# EAGLE design AntilogMM (EAGLE 9.0.1)
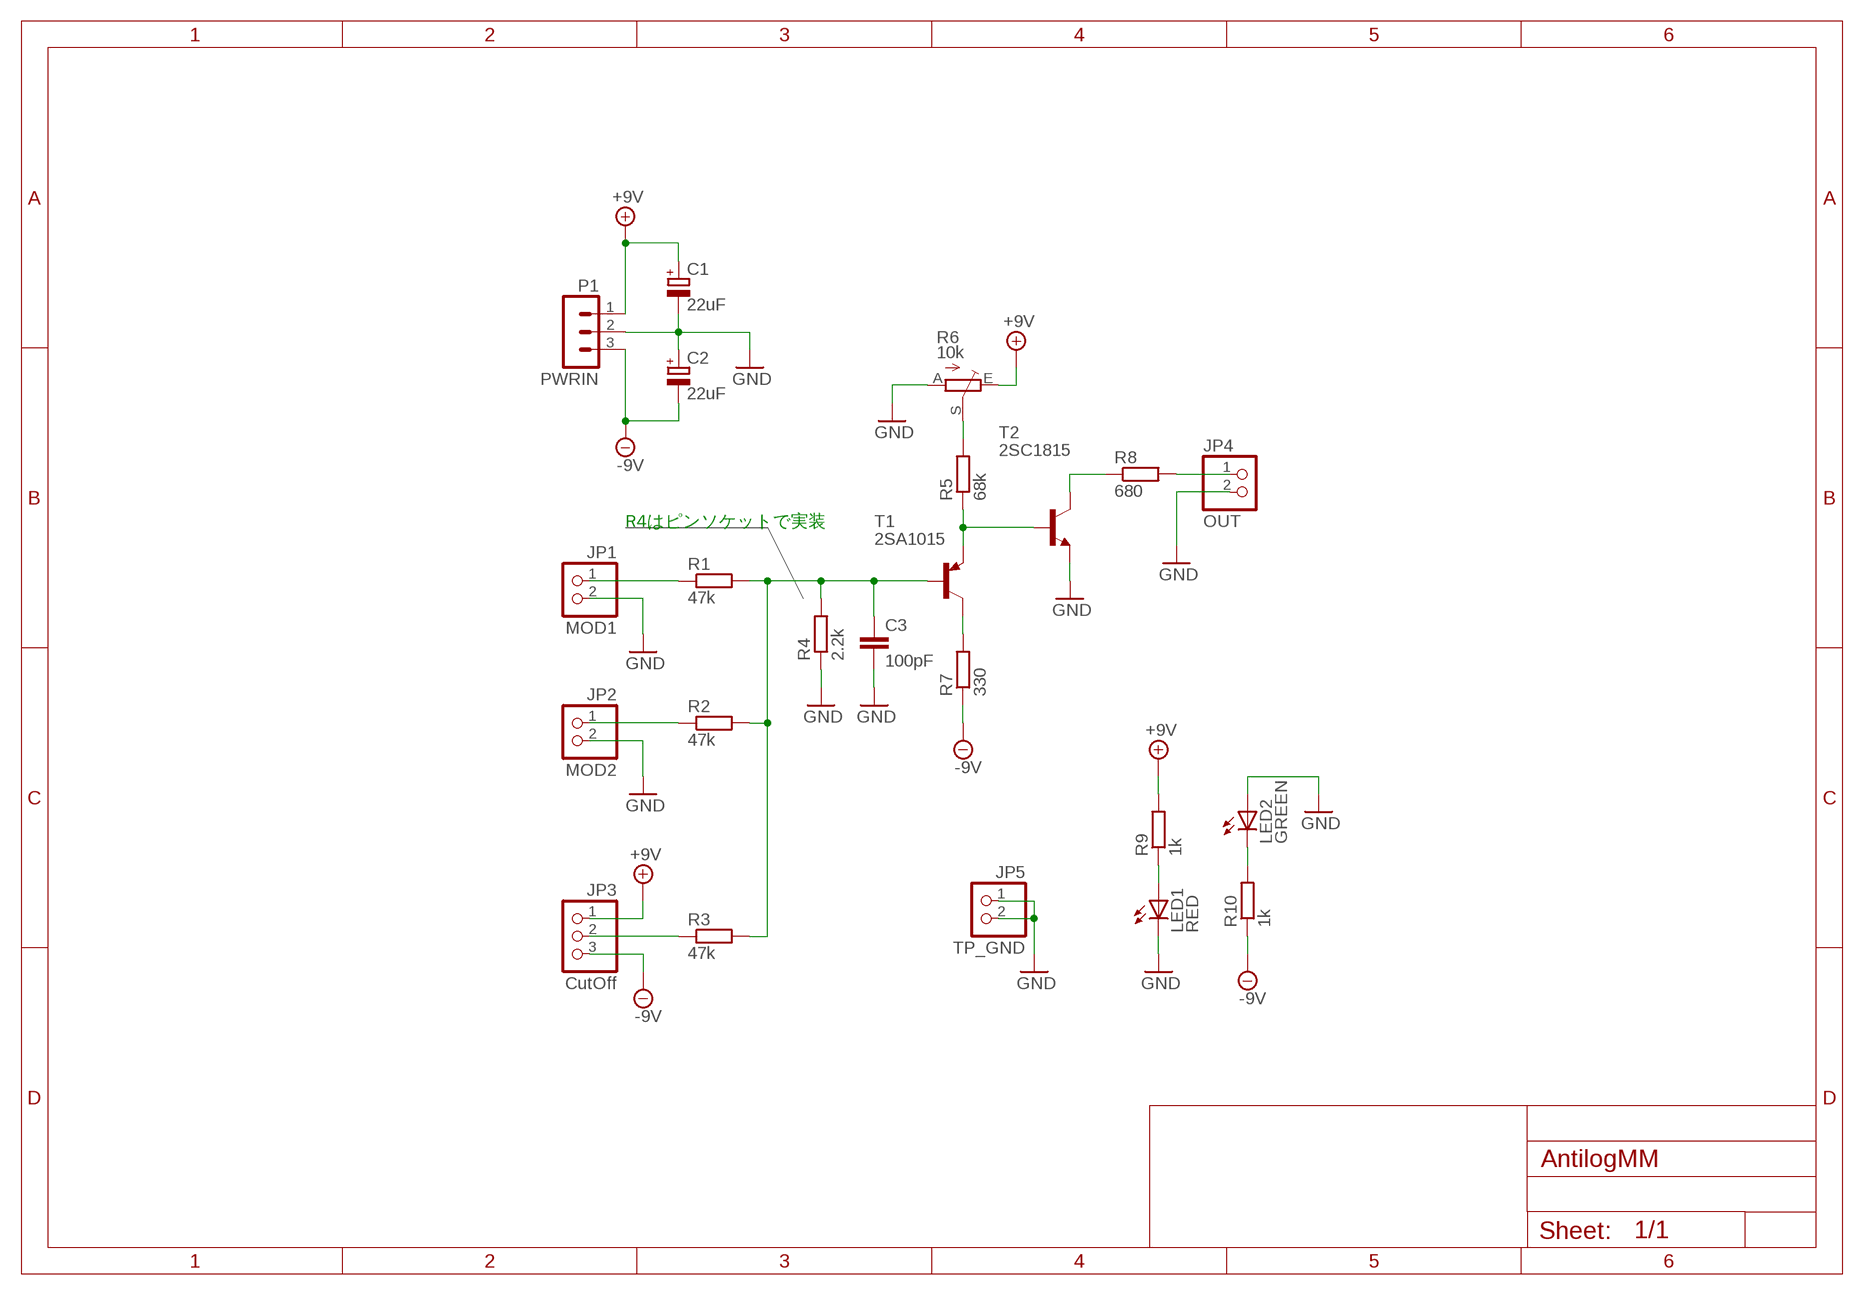
[diagram p0: schematic, sheet 1]

## Parts
C1  22uF  CPOL-EUE2.5-6  [E2,5-6]
C2  22uF  CPOL-EUE2.5-6  [E2,5-6]
C3  100pF  C-EU050-024X044  [C050-024X044]
JP1  MOD1  PINHD-1X2  [1X02]
JP2  MOD2  PINHD-1X2  [1X02]
JP3  CutOff  PINHD-1X3  [1X03]
JP4  OUT  PINHD-1X2  [1X02]
JP5  TP_GND  PINHD-1X2  [1X02]
LED1  RED  LED3MM  [LED3MM]
LED2  GREEN  LED3MM  [LED3MM]
P1  PWRIN  B3B-EH-A  [B3B-EH-A]
R1  47k  R-EU_0207/7  [0207/7]
R2  47k  R-EU_0207/7  [0207/7]
R3  47k  R-EU_0207/7  [0207/7]
R4  2.2k  R-EU_0207/7  [0207/7]
R5  68k  R-EU_0207/7  [0207/7]
R6  10k  TRIM_EU-B25P  [B25P]
R7  330  R-EU_0207/7  [0207/7]
R8  680  R-EU_0207/7  [0207/7]
R9  1k  R-EU_0207/7  [0207/7]
R10  1k  R-EU_0207/7  [0207/7]
T1  2SA1015  -PNP-TO92-ECB  [TO92-ECB]
T2  2SC1815  -NPN-TO92-ECB  [TO92-ECB]

## Nets
+9V: C1.+ JP3.1 P1.1 R6.E R9.2
-9V: C2.- JP3.3 P1.3 R7.1 R10.1
GND: C1.- C2.+ C3.2 JP1.2 JP2.2 JP4.2 JP5.1 JP5.2 LED1.K(C) LED2.A P1.2 R4.1 R6.A T2.E
N$1: R8.1 T2.C
N$2: R7.2 T1.C
N$3: LED2.K(C) R10.2
N$4: JP4.1 R8.2
N$5: LED1.A R9.1
N$7: R5.2 R6.S
N$8: R5.1 T1.E T2.B
N$9: C3.1 R1.2 R2.2 R3.2 R4.2 T1.B
N$10: JP1.1 R1.1
N$13: JP2.1 R2.1
N$14: JP3.2 R3.1

## Notes on the sheet
- R4はピンソケットで実装

## Library data of the parts
C1 C2 = rcl:CPOL-EU: POLARIZED CAPACITOR, European symbol; SPICEPREFIX: C
C3 = rcl:C-EU: CAPACITOR, European symbol; SPICEPREFIX: C
JP1 JP2 JP4 JP5 = pinhead:PINHD-1X2: PIN HEADER
JP3 = pinhead:PINHD-1X3: PIN HEADER
LED1 LED2 = led:LED: LED OSRAM: - CHIPLED LG R971, LG N971, LY N971, LG Q971, LY Q971, LO R971, LY R971 LH N974, LH R974 LS Q976, LO Q976, LY Q976 LO Q996 - Hyper CHIPLED LW Q18S LB Q993, LB Q99A, LB R99A - SideLED LS A670, LO A670, LY A670, LG A670, LP A670 LB A673, LV A673, LT A673, LW A673 LH A674 LY A675 LS A676, LA A676, LO A676, LY A676, LW A676 LS A679, LY A679, LG A679 - Hyper Micro SIDELED® LS Y876, LA Y876, LO Y876, LY Y876 LT Y87S - SmartLED LW L88C, LW L88S LB L89C, LB L89S, LG L890 LS L89K, LO L89K, LY L89K LS L896, LA L896, LO L896, LY L896 - TOPLED LS T670, LO T670, LY T670, LG T670, LP T670 LSG T670, LSP T670, LSY T670, LOP T670, LYG T670 LG T671, LOG T671, LSG T671 LB T673, LV T673, LT T673, LW T673 LH T674 LS T676, LA T676, LO T676, LY T676, LB T676, LH T676, LSB T676, LW T676 LB T67C, LV T67C, LT T67C, LS T67K, LO T67K, LY T67K, LW E67C LS E67B, LA E67B, LO E67B, LY E67B, LB E67C, LV E67C, LT E67C LW T67C LS T679, LY T679, LG T679 LS T770, LO T770, LY T770, LG T770, LP T770 LB T773, LV T773, LT T773, LW T773 LH T774 LS E675, LA E675, LY E675, LS T675 LS T776, LA T776, LO T776, LY T776, LB T776 LHGB T686 LT T68C, LB T68C - Hyper Mini TOPLED® LB M676 - Mini TOPLED Santana® LG M470 LS M47K, LO M47K, LY M47K Source: http://www.osram.convergy.de LUXEON: - LUMILED® LXK2-PW12-R00, LXK2-PW12-S00, LXK2-PW14-U00, LXK2-PW14-V00 LXK2-PM12-R00, LXK2-PM12-S00, LXK2-PM14-U00 LXK2-PE12-Q00, LXK2-PE12-R00, LXK2-PE12-S00, LXK2-PE14-T00, LXK2-PE14-U00 LXK2-PB12-K00, LXK2-PB12-L00, LXK2-PB12-M00, LXK2-PB14-N00, LXK2-PB14-P00, LXK2-PB14-Q00 LXK2-PR12-L00, LXK2-PR12-M00, LXK2-PR14-Q00, LXK2-PR14-R00 LXK2-PD12-Q00, LXK2-PD12-R00, LXK2-PD12-S00 LXK2-PH12-R00, LXK2-PH12-S00 LXK2-PL12-P00, LXK2-PL12-Q00, LXK2-PL12-R00 Source: www.luxeon.com KINGBRIGHT: KA-3528ASYC Source: www.kingbright.com
P1 = con-jst-eh:B3B-EH-A: HEADER
R1-R5 R7-R10 = rcl:R-EU_: RESISTOR, European symbol; SPICEPREFIX: R
R6 = pot:TRIM_EU-: POTENTIOMETER
T1 = transistor-neu-to92:*-PNP-: PNP Transistror
T2 = transistor:*-NPN-: NPN Transistror BF959 corrected 2008.03.06

## Board
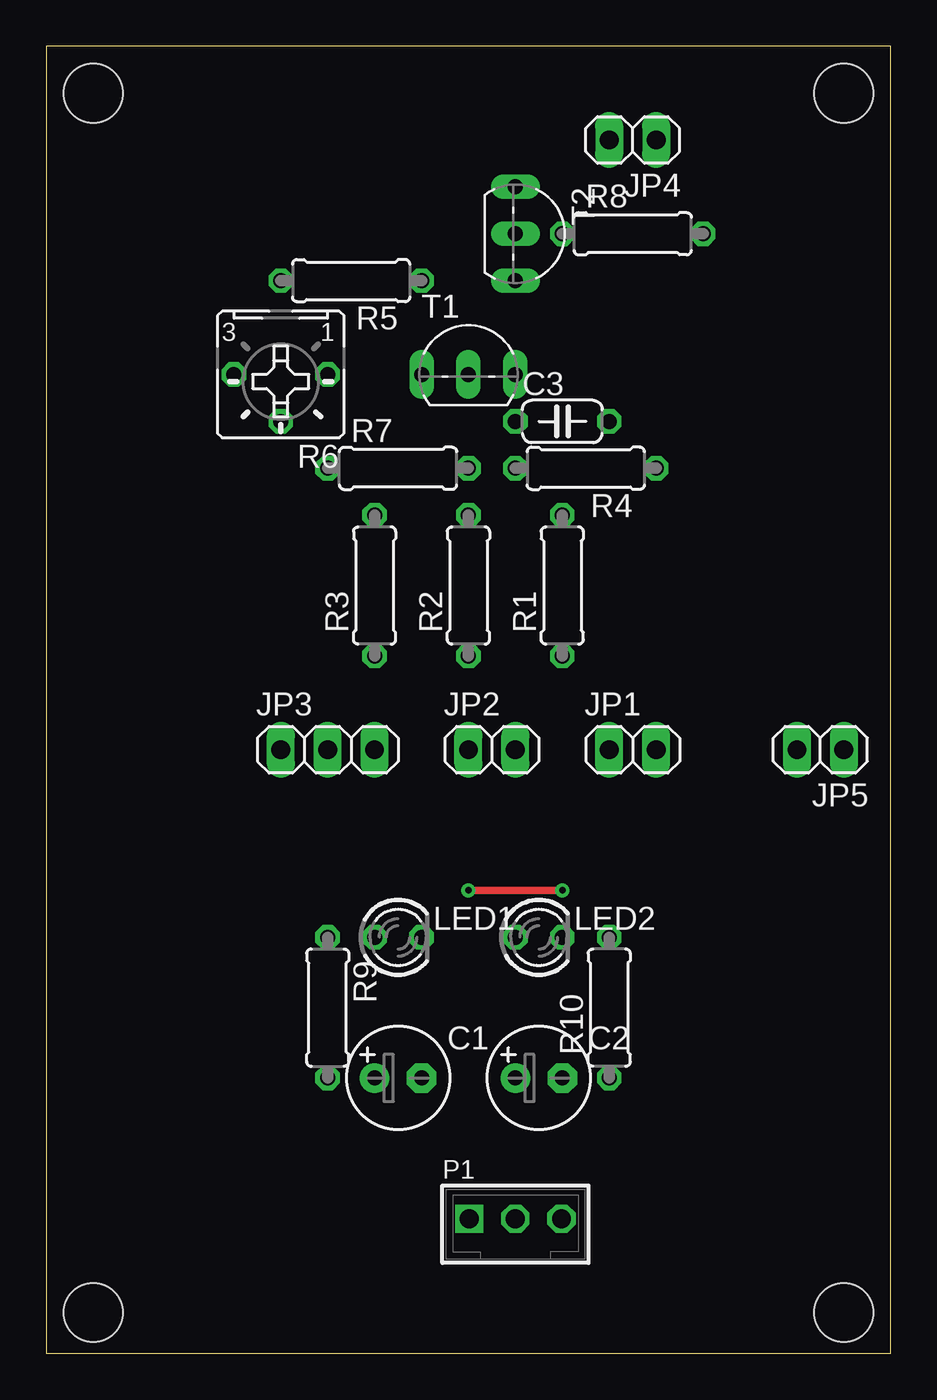
[diagram p1: board, top side]
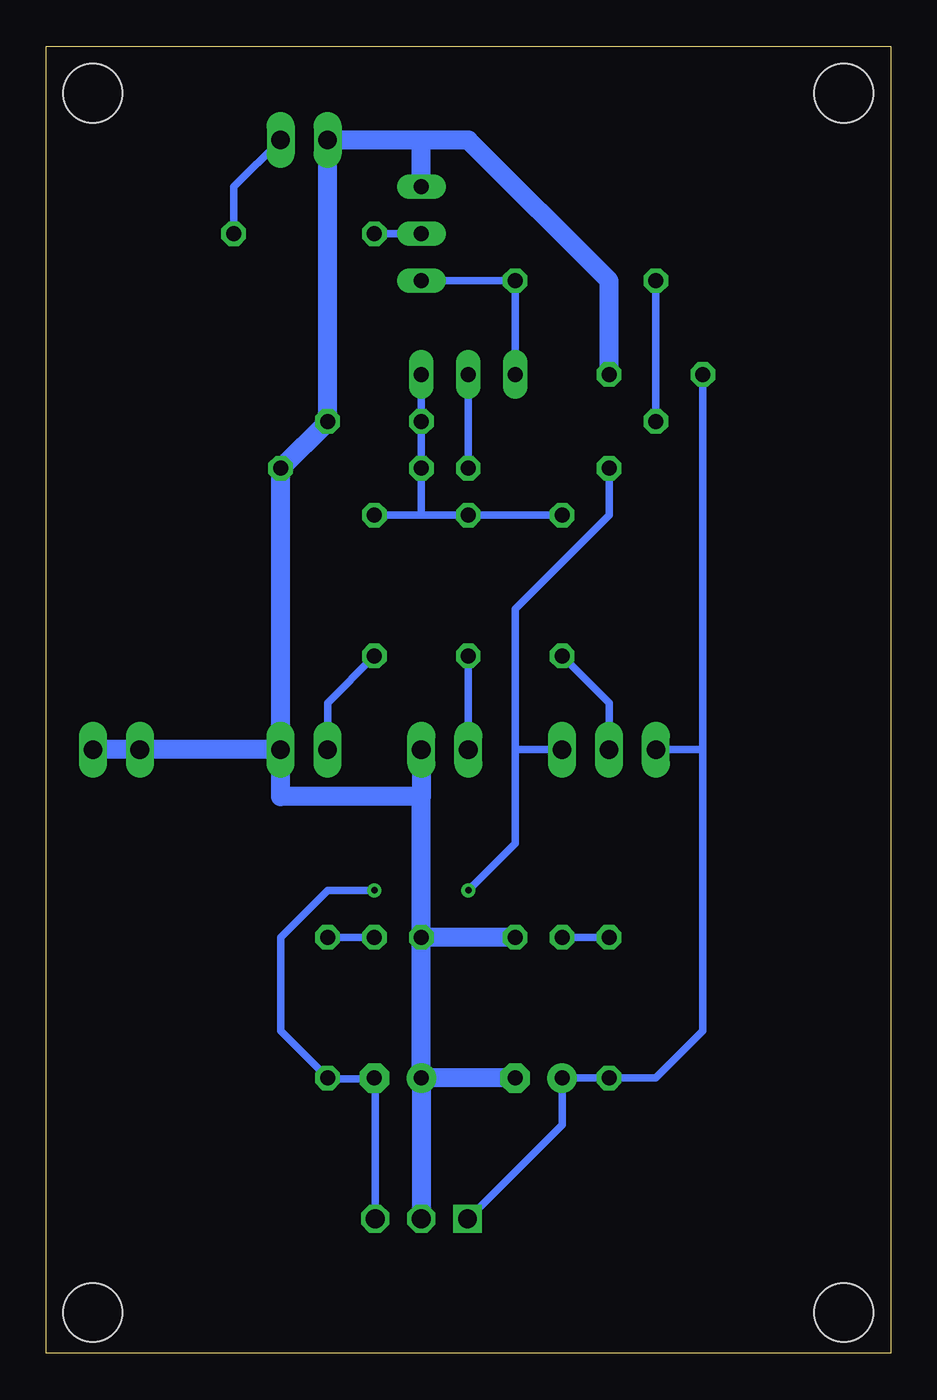
[diagram p2: board, bottom side, seen from below]

Size 45.71 x 70.79 mm. Coordinates in mm from the lower left corner, seen from the top.
Outline: 0,70.79 0,0 45.71,0 45.71,70.79 0,70.79
Copper layers (1*16): Top 0.035mm / dielectric 1.5mm / Bottom 0.035mm
Design rules "default": minimum track width 6mil, minimum drill 0.35mm, track to track 6mil, track to pad 6mil, pad to pad 6mil, via to via 6mil, smd to smd 6mil, copper to edge 40mil, drill to drill 6mil, minimum pad ring 10mil, minimum via ring 8mil, stop-mask expansion 4mil, vias tented up to drill 0mil, thermal gap 10mil
Holes 3.2 mm at 43.18,68.25 2.54,68.25 43.18,2.21 2.54,2.21

### Footprints (pad centres in the part's own frame; a part is rotated, then mirrored left to right if it is on the bottom)
E2,5-6 = drill 0.813 pad 1.6: + -1.27,0 | drill 0.813 pad 1.6 octagon: - 1.27,0
C050-024X044 = drill 0.813 octagon: 1 -2.54,0; 2 2.54,0
1X02 = drill 1.016 long: 1 -1.27,0; 2 1.27,0
1X03 = drill 1.016 long: 1 -2.54,0; 2 0,0; 3 2.54,0
LED3MM = drill 0.813 octagon: A -1.27,0; K 1.27,0
B3B-EH-A = drill 1.016 square: 1 -2.5,0 | drill 1.016 octagon: 2 0,0; 3 2.5,0
0207/7 = drill 0.813 octagon: 1 -3.81,0; 2 3.81,0
B25P = drill 0.813 octagon: A -2.54,0; E 2.54,0; S 0,2.54
TO92-ECB = drill 0.813 long: B 2.54,0; C 0,0; E -2.54,0

### Placement (x,y rotation side)
C1  19.05,14.91 0 top
C2  26.67,14.91 0 top
C3  27.94,50.47 0 top
JP1  31.75,32.69 0 top
JP2  24.13,32.69 0 top
JP3  15.24,32.69 0 top
JP4  31.75,65.71 180 top
JP5  41.91,32.69 180 top
LED1  19.05,22.53 0 top
LED2  26.67,22.53 0 top
P1  25.4,7.29 0 top
R1  27.94,41.58 90 top
R2  22.86,41.58 90 top
R3  17.78,41.58 90 top
R4  29.21,47.93 180 top
R5  16.51,58.09 180 top
R6  12.7,53.01 180 top
R7  19.05,47.93 0 top
R8  31.75,60.63 0 top
R9  15.24,18.72 270 top
R10  30.48,18.72 90 top
T1  22.86,53.01 0 top
T2  25.4,60.63 270 top

### Tracks (layer width: path | path; a pad name or v marks a point on that pad's centre or on a via)
+9V
  Bottom 0.406: P1.1 22.86,7.29 17.78,12.37 C1.+ R9.2 12.7,14.91 10.16,17.45 10.16,32.69 | 10.16,32.69 R6.E | JP3.1 10.16,32.69
-9V  (via drill 0.35)
  Top 0.406: v27.94,25.07 v22.86,25.07
  Bottom 0.406: C2.- 27.9,14.87 | 27.9,14.87 P1.3 | 27.9,14.87 30.44,14.87 R10.1 33.02,17.45 33.02,22.53 30.48,25.07 v27.94,25.07 | R7.1 15.24,45.39 20.32,40.31 20.32,32.69 | JP3.3 20.32,32.69 | v22.86,25.07 20.32,27.61 20.32,32.69
GND
  Bottom 1.016: C2.+ LED2.A | C2.+ P1.2 | JP1.2 R4.1 C3.2 JP4.2 25.4,65.71 | R6.A 15.24,58.09 22.86,65.71 25.4,65.71 | LED2.A 25.4,30.15 | 25.4,30.15 33.02,30.15 JP1.2 | JP2.2 25.4,30.15 | C1.- C2.+ | LED1.K LED2.A | JP1.2 JP5.2 JP5.1 | T2.E 25.4,65.71
N$1
  Bottom 0.406: T2.C R8.1
N$2
  Bottom 0.406: T1.C R7.2
N$3
  Bottom 0.406: LED2.K R10.2
N$4
  Bottom 0.406: R8.2 35.56,63.17 JP4.1
N$5
  Bottom 0.406: R9.1 LED1.A
N$7
  Bottom 0.406: R6.S R5.2
N$8
  Bottom 0.406: T2.B R5.1 T1.E
N$9
  Bottom 0.406: R3.2 R2.2 25.4,45.39 | 25.4,45.39 R1.2 | 25.4,45.39 R4.2 C3.1 T1.B
N$10
  Bottom 0.406: JP1.1 30.48,35.23 R1.1
N$13
  Bottom 0.406: R2.1 JP2.1
N$14
  Bottom 0.406: JP3.2 15.24,35.23 R3.1

### Text on the board
tDocu: http://dad8893.blogspot.com/ | AntiLog-MM
PinSocket: はPinSocketで実装